# EAGLE design PCB_project (EAGLE 9.6.2)
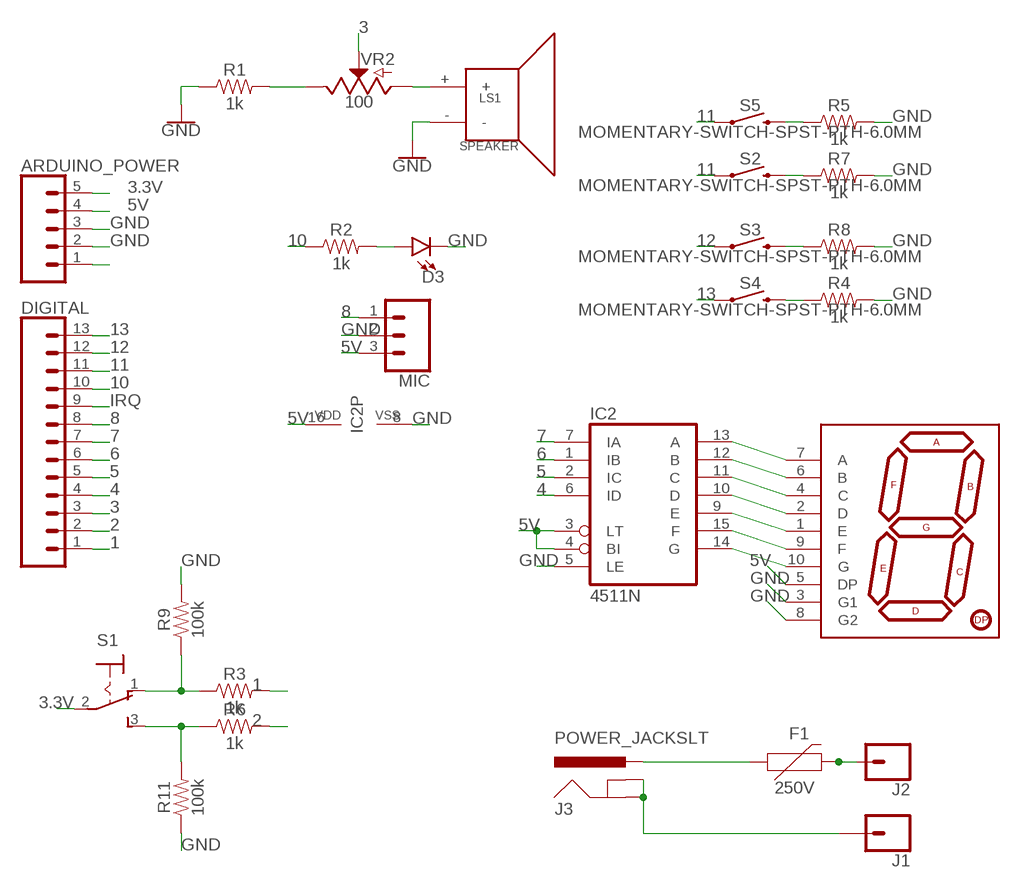
[diagram p0: schematic, sheet 1]

## Parts
ARDUINO_POWER  CONN_05  [1X05]
D3  LED-3MM-NO_SILK  [LED_3MM-NS]
DIGITAL  CONN_13  [1X13]
F1  250V  PPTC_HALF-AMP  [1206]
IC2  4511N  [DIL16]
J1  CONN_01  [1X01]
J2  CONN_01  [1X01]
J3  POWER_JACKSLT  [POWER_JACK_SLOT]
LS1  SPEAKER  [PCB_MOUNT_SPEAKER]
MIC  CONN_03  [1X03]
R1  1k  1KOHM-HORIZ-1/4W-1%  [AXIAL-0.3]
R2  1k  1KOHM-HORIZ-1/4W-1%  [AXIAL-0.3]
R3  1k  1KOHM-HORIZ-1/4W-1%  [AXIAL-0.3]
R4  1k  1KOHM-HORIZ-1/4W-1%  [AXIAL-0.3]
R5  1k  1KOHM-HORIZ-1/4W-1%  [AXIAL-0.3]
R6  1k  1KOHM-HORIZ-1/4W-1%  [AXIAL-0.3]
R7  1k  1KOHM-HORIZ-1/4W-1%  [AXIAL-0.3]
R8  1k  1KOHM-HORIZ-1/4W-1%  [AXIAL-0.3]
R9  100k  100KOHM-HORIZ-1/4W-1%  [AXIAL-0.3]
R11  100k  100KOHM-HORIZ-1/4W-1%  [AXIAL-0.3]
S1  320-916  [320-916]
S2  MOMENTARY-SWITCH-SPST-PTH-6.0MM  [TACTILE_SWITCH_PTH_6.0MM]
S3  MOMENTARY-SWITCH-SPST-PTH-6.0MM  [TACTILE_SWITCH_PTH_6.0MM]
S4  MOMENTARY-SWITCH-SPST-PTH-6.0MM  [TACTILE_SWITCH_PTH_6.0MM]
S5  MOMENTARY-SWITCH-SPST-PTH-6.0MM  [TACTILE_SWITCH_PTH_6.0MM]
U$1  YSD-160AB3C-8  7-SEGMENT-1DIGIT-1INCH-BLUE  [7-SEGMENT-1"PTH]
VR2  100  POTENTIOMETER-PTH-9MM-1/20W-20%  [POT-PTH-ALPS]

## Nets
1: DIGITAL.1 R3.P$2
2: DIGITAL.2 R6.P$2
3: DIGITAL.3 VR2.P$2(S)
3.3V: ARDUINO_POWER.5 S1.2(P)
4: DIGITAL.4 IC2.6(ID)
5: DIGITAL.5 IC2.2(IC)
5V: ARDUINO_POWER.4 IC2.3(LT) IC2.4(BI) IC2.16(VDD) MIC.3 U$1.5(DP)
6: DIGITAL.6 IC2.1(IB)
7: DIGITAL.7 IC2.7(IA)
8: DIGITAL.8 MIC.1
10: DIGITAL.10 R2.P$1
11: DIGITAL.11 S2.1 S5.1
12: DIGITAL.12 S3.1
13: DIGITAL.13 S4.1
GND: ARDUINO_POWER.2 ARDUINO_POWER.3 D3.K(C) IC2.5(LE) IC2.8(VSS) LS1.- MIC.2 R1.P$1 R4.P$2 R5.P$2 R7.P$2 R8.P$2 R9.P$2 R11.P$1 U$1.3(G1) U$1.8(G2)
IRQ: DIGITAL.9
N$1: LS1.+ VR2.P$3(A)
N$2: D3.A R2.P$2
N$3: IC2.13(A) U$1.7(A)
N$4: IC2.12(B) U$1.6(B)
N$5: IC2.11(C) U$1.4(C)
N$6: IC2.10(D) U$1.2(D)
N$7: IC2.9(E) U$1.1(E)
N$8: IC2.15(F) U$1.9(F)
N$9: IC2.14(G) U$1.10(G)
N$10: R1.P$2 VR2.P$1(E)
N$11: R3.P$1 R9.P$1 S1.1(O)
N$12: R4.P$1 S4.3
N$13: J1.1 J3.GND@1(GNDBREAK) J3.GND@2(GND)
N$14: ARDUINO_POWER.1
N$15: R6.P$1 R11.P$2 S1.3(S)
N$16: R7.P$1 S2.3
N$17: R8.P$1 S3.3
N$18: F1.1 J3.PWR
N$19: R5.P$1 S5.3
N$20: F1.2 J2.1

## Library data of the parts
ARDUINO_POWER = SparkFun-Connectors:CONN_05: Multi connection point. Often used as Generic Header-pin footprint for 0.1 inch spaced/style header connections On any of the 0.1 inch spaced packages, you can populate with these: Break Away Headers - Straight <https://www.sparkfun.com/products/116> (PRT-00116) Break Away Male Headers - Right Angle <https://www.sparkfun.com/products/553> (PRT-00553) Female Headers <https://www.sparkfun.com/products/115> (PRT-00115) Break Away Headers - Machine Pin <https://www.sparkfun.com/products/117> (PRT-00117) Break Away Female Headers - Swiss Machine Pin <https://www.sparkfun.com/products/743> (PRT-00743) For SCREWTERMINALS and SPRING TERMINALS visit here: Screw Terimnals on SparkFun.com <https://www.sparkfun.com/search/results?term=Screw+Terminals> (5mm/3.5mm/2.54mm spacing) This device is also useful as a general connection point to wire up your design to another part of your project. Our various solder wires solder well into these plated through hole pads. Hook-Up Wire - Assortment (Stranded, 22 AWG) <https://www.sparkfun.com/products/11375> (PRT-11375) Hook-Up Wire - Assortment (Solid Core, 22 AWG) <https://www.sparkfun.com/products/11367> (PRT-11367) View the entire wire category on our website here <https://www.sparkfun.com/categories/141> Special notes: Molex polarized connector foot print use with SKU : PRT-08231 with associated crimp pins and housings. 1MM SMD Version SKU: PRT-10208
D3 = SparkFun-LED:LED: LED (Generic) Standard schematic elements and footprints for 5mm, 3mm, 1206, and 0603 sized LEDs. Generic LEDs with no color specified.
DIGITAL = SparkFun-Connectors:CONN_13: Multi connection point. Often used as Generic Header-pin footprint for 0.1 inch spaced/style header connections On any of the 0.1 inch spaced packages, you can populate with these: Break Away Headers - Straight <https://www.sparkfun.com/products/116> (PRT-00116) Break Away Male Headers - Right Angle <https://www.sparkfun.com/products/553> (PRT-00553) Female Headers <https://www.sparkfun.com/products/115> (PRT-00115) Break Away Headers - Machine Pin <https://www.sparkfun.com/products/117> (PRT-00117) Break Away Female Headers - Swiss Machine Pin <https://www.sparkfun.com/products/743> (PRT-00743) For SCREWTERMINALS and SPRING TERMINALS visit here: Screw Terimnals on SparkFun.com <https://www.sparkfun.com/search/results?term=Screw+Terminals> (5mm/3.5mm/2.54mm spacing) This device is also useful as a general connection point to wire up your design to another part of your project. Our various solder wires solder well into these plated through hole pads. Hook-Up Wire - Assortment (Stranded, 22 AWG) <https://www.sparkfun.com/products/11375> (PRT-11375) Hook-Up Wire - Assortment (Solid Core, 22 AWG) <https://www.sparkfun.com/products/11367> (PRT-11367) View the entire wire category on our website here <https://www.sparkfun.com/categories/141> Special notes: Molex polarized connector foot print use with SKU : PRT-08231 with associated crimp pins and housings. 1MM SMD Version SKU: PRT-10208 NOTES ON THE VARIANTS LOCK and LOCK_LONGPADS... This footprint was designed to help hold the alignment of a through-hole component (i.e. 6-pin header) while soldering it into place. You may notice that each hole has been shifted either up or down by 0.005 of an inch from it's more standard position (which is a perfectly straight line). This slight alteration caused the pins (the squares in the middle) to touch the edges of the holes. Because they are alternating, it causes a "brace" to hold the component in place. 0.005 has proven to be the perfect amount of "off-center" position when using our standard breakaway headers. Although looks a little odd when you look at the bare footprint, once you have a header in there, the alteration is very hard to notice. Also,if you push a header all the way into place, it is covered up entirely on the bottom side.
F1 = SparkFun-Fuses:PPTC: Resettable Fuse PPTC Resettable Fuse. Really a sort of resistor with a polymeric positive temperature coefficient whose resistance increases dramatically with an increase in temperature. When heated by the power passing through the resistance rises causing the current to be limited, protecting the circuit. This is achieved by the transition of the polymer from a crystalline to an amorphous state where the conductive carbon separates breaking the conductive pathways found in the cool crystalline structure. When a PPTC cools back down it resumes conducting letting the circuit turn back on. SparkFun Products: SparkFun RedBoard - Programmed with Arduino <https://www.sparkfun.com/products/12757> Pro Micro - 5V/16MHz <https://www.sparkfun.com/products/12640> Arduino Pro 328 - 5V/16MHz <https://www.sparkfun.com/products/10915> MP3 Trigger <https://www.sparkfun.com/products/13720>; PROD_ID: RES-08585; VALUE: 6V/0.5A
IC2 = 45xx:4511: BCD to 7-segment LATCH/DECODER/DRIVER
J1 J2 = SparkFun-Connectors:CONN_01: Single connection point. Often used as Generic Header-pin footprint for 0.1 inch spaced/style header connections On any of the 0.1 inch spaced packages, you can populate with these: Break Away Headers - Straight <https://www.sparkfun.com/products/116> (PRT-00116) Break Away Male Headers - Right Angle <https://www.sparkfun.com/products/553> (PRT-00553) Female Headers <https://www.sparkfun.com/products/115> (PRT-00115) Break Away Headers - Machine Pin <https://www.sparkfun.com/products/117> (PRT-00117) Break Away Female Headers - Swiss Machine Pin <https://www.sparkfun.com/products/743> (PRT-00743) This device is also useful as a general connection point to wire up your design to another part of your project. Our various solder wires solder well into these plated through hole pads. Hook-Up Wire - Assortment (Stranded, 22 AWG) <https://www.sparkfun.com/products/11375> (PRT-11375) Hook-Up Wire - Assortment (Solid Core, 22 AWG) <https://www.sparkfun.com/products/11367> (PRT-11367) View the entire wire category on our website here <https://www.sparkfun.com/categories/141> Special notes: SMTSO-256-ET is a "flush mount" nut for a 4-40 screw. We mostly use this on specialty testbeds; it is a nice way to connect hardware to your PCB at an adjustable hieght. Also note, the SNAP packages are for using a snappable style connector. We sell a baggie of snaps and they are also used on two LilyPad designs: Snap Assortment - 30 pack (male and female) <https://www.sparkfun.com/products/11347> (DEV-11347) LilyPad Arduino SimpleSnap <https://www.sparkfun.com/products/10941> (DEV-10941) LilyPad SimpleSnap Protoboard <https://www.sparkfun.com/products/10940> (DEV-10940)
J3 = SparkFun-Connectors:POWER_JACK: Power Jack Connector This is the standard 5.5mm barrel jack for power. The PTH is the most common, proven, reliable, footprint. The Slot footprint only works if the mill layer is transmitted to the PCB fab house so be warned. Here are the connectors we sell at SparkFun: DC Barrel Power Jack/Connector <https://www.sparkfun.com/products/119> (PRT-00119) DC Barrel Power Jack/Connector (SMD) <https://www.sparkfun.com/products/12748> (PRT-12748) DC Barrel Jack Adapter - Breadboard Compatible <https://www.sparkfun.com/products/10811> (PRT-10811) It is used on this SparkFun product (and many, many others): SparkFun RedBoard - Programmed with Arduino <https://www.sparkfun.com/products/12757> (DEV-12757) Also, if you need a mating power supply or connector, please check these out: Wall Adapter Power Supply - 9VDC 650mA <https://www.sparkfun.com/products/298> (TOL-00298) DC Barrel Jack Adapter - Male <https://www.sparkfun.com/products/10287> (PRT-10287); PROD_ID: PRT-00119
LS1 = SparkFun-Electromechanical:SPEAKER: Speaker Generic 2-terminal loudspeakers SparkFun Products Speaker - PCB Mount <https://www.sparkfun.com/products/11089> (COM-11089); PROD_ID: COMP-11789; SF_SKU: COM-11089
MIC = SparkFun-Connectors:CONN_03: Multi connection point. Often used as Generic Header-pin footprint for 0.1 inch spaced/style header connections On any of the 0.1 inch spaced packages, you can populate with these: Break Away Headers - Straight <https://www.sparkfun.com/products/116> (PRT-00116) Break Away Male Headers - Right Angle <https://www.sparkfun.com/products/553> (PRT-00553) Female Headers <https://www.sparkfun.com/products/115> (PRT-00115) Break Away Headers - Machine Pin <https://www.sparkfun.com/products/117> (PRT-00117) Break Away Female Headers - Swiss Machine Pin <https://www.sparkfun.com/products/743> (PRT-00743) Stackable Header - 3 Pin (Female, 0.1") <https://www.sparkfun.com/products/13875> (PRT-13875) For SCREWTERMINALS and SPRING TERMINALS visit here: Screw Terimnals on SparkFun.com <https://www.sparkfun.com/search/results?term=Screw+Terminals> (5mm/3.5mm/2.54mm spacing) This device is also useful as a general connection point to wire up your design to another part of your project. Our various solder wires solder well into these plated through hole pads. Hook-Up Wire - Assortment (Stranded, 22 AWG) <https://www.sparkfun.com/products/11375> (PRT-11375) Hook-Up Wire - Assortment (Solid Core, 22 AWG) <https://www.sparkfun.com/products/11367> (PRT-11367) View the entire wire category on our website here <https://www.sparkfun.com/categories/141> Special notes: Molex polarized connector foot print use with SKU : PRT-08232 with associated crimp pins and housings.
R1-R8 = SparkFun-Resistors:1KOHM: 1kΩ resistor A resistor is a passive two-terminal electrical component that implements electrical resistance as a circuit element. Resistors act to reduce current flow, and, at the same time, act to lower voltage levels within circuits. - Wikipedia; PROD_ID: RES-12182
R9 R11 = SparkFun-Resistors:100KOHM: 100kΩ resistor A resistor is a passive two-terminal electrical component that implements electrical resistance as a circuit element. Resistors act to reduce current flow, and, at the same time, act to lower voltage levels within circuits. - Wikipedia; PROD_ID: RES-12184
S1 = switch:320-916: TOGGLE SWITCH distributor RS Components
S2-S5 = SparkFun-Switches:MOMENTARY-SWITCH-SPST: Momentary Switch (Pushbutton) - SPST Normally-open (NO) SPST momentary switches (buttons, pushbuttons). Variants PTH-12MM - 12mm square, through-hole Momentary Pushbutton Switch - 12mm Square <https://www.sparkfun.com/products/9190> (COM-09190) PTH-6.0MM, PTH-6.0MM-KIT - 6.0mm square, through-hole Mini Pushbutton Switch <https://www.sparkfun.com/products/97> (COM-00097) KIT package intended for soldering kit's - only one side of pads' copper is exposed. PTH-RIGHT-ANGLE-KIT - Right-angle, through-hole Right Angle Tactile Button <https://www.sparkfun.com/products/10791> - Used on SparkFun BigTime Watch Kit <https://www.sparkfun.com/products/11734> SMD-12MM - 12mm square, surface-mount Tactile Button - SMD (12mm) <https://www.sparkfun.com/products/12993> (COM-12993) Used on SparkFun PicoBoard <https://www.sparkfun.com/products/11888> SMD-4.5MM - 4.5mm Square Trackball Switch Used on SparkFun Blackberry Trackballer Breakout <https://www.sparkfun.com/products/13169> SMD-4.6MMX2.8MM - 4.60mm x 2.80mm, surface mount Used on SparkFun SAMD21 Mini Breakout <https://www.sparkfun.com/products/13664> SMD-5.2MM, SMD-5.2-REDUNDANT - 5.2mm square, surface-mount Mini Pushbutton Switch - SMD <https://www.sparkfun.com/products/8720> (COM-08720) Used on Arduino Pro Mini <https://www.sparkfun.com/products/11114> REDUNDANT package connects both switch circuits together SMD-6.0X3.5MM - 6.0 x 3.5mm, surface mount Momentary Reset Switch SMD <https://www.sparkfun.com/products/8229> (COM-08229) SMD-6.2MM-TALL - 6.2mm square, surface mount Tactile Button - SMD (6mm) <https://www.sparkfun.com/products/12992> Used on SparkFun Digital Sandbox <https://www.sparkfun.com/products/12651> SMD-RIGHT-ANGLE - Right-angle, surface mount Used on SparkFun Block for Intel® Edison - Arduino <https://www.sparkfun.com/products/13036>; PROD_ID: SWCH-08441; SF_SKU: COM-00097
U$1 = SparkFun-LED:7-SEGMENT-1DIGIT-1INCH: 7-Segment Display, single digit, 1" EZ is for kits. Pads are only exposed on the bottom side to help prevent soldering in upside down. Datasheet (Red) <https://cdn.sparkfun.com/datasheets/Components/LED/YSD-160AR4B-8.pdf> Datasheet (Blue) <https://cdn.sparkfun.com/datasheets/Components/LED/YSD-160AB3C-8.pdf> SparkFun Products 7-Segment Display - LED (Red) <https://www.sparkfun.com/products/8546> (COM-08546) 7-Segment Display - LED (Blue) <https://www.sparkfun.com/products/9191> (COM-09191); PROD_ID: COMP-09495
VR2 = SparkFun-Resistors:POTENTIOMETER: Potentiometer (Pot) Three-terminal potentiometers, with an adjustable wiper and two adjustable resistors. A pot can be used to create a configurable voltage divider, or as a variable resistor. Variants ALPS_POT and ALPS_POT_KIT - PTH, breadboard compatible, 9mm square pots Rotary Potentiometer - Linear (10k ohm) <https://www.sparkfun.com/products/9288> (COM-09288) The KIT variant exposes copper on only one side of the PTH pad, so the part can only be assembled on one side of the PCB. Useful for beginner soldering kits.; PROD_ID: RES-09177; SF_SKU: COM-09288; VALUE: 10k

## Board
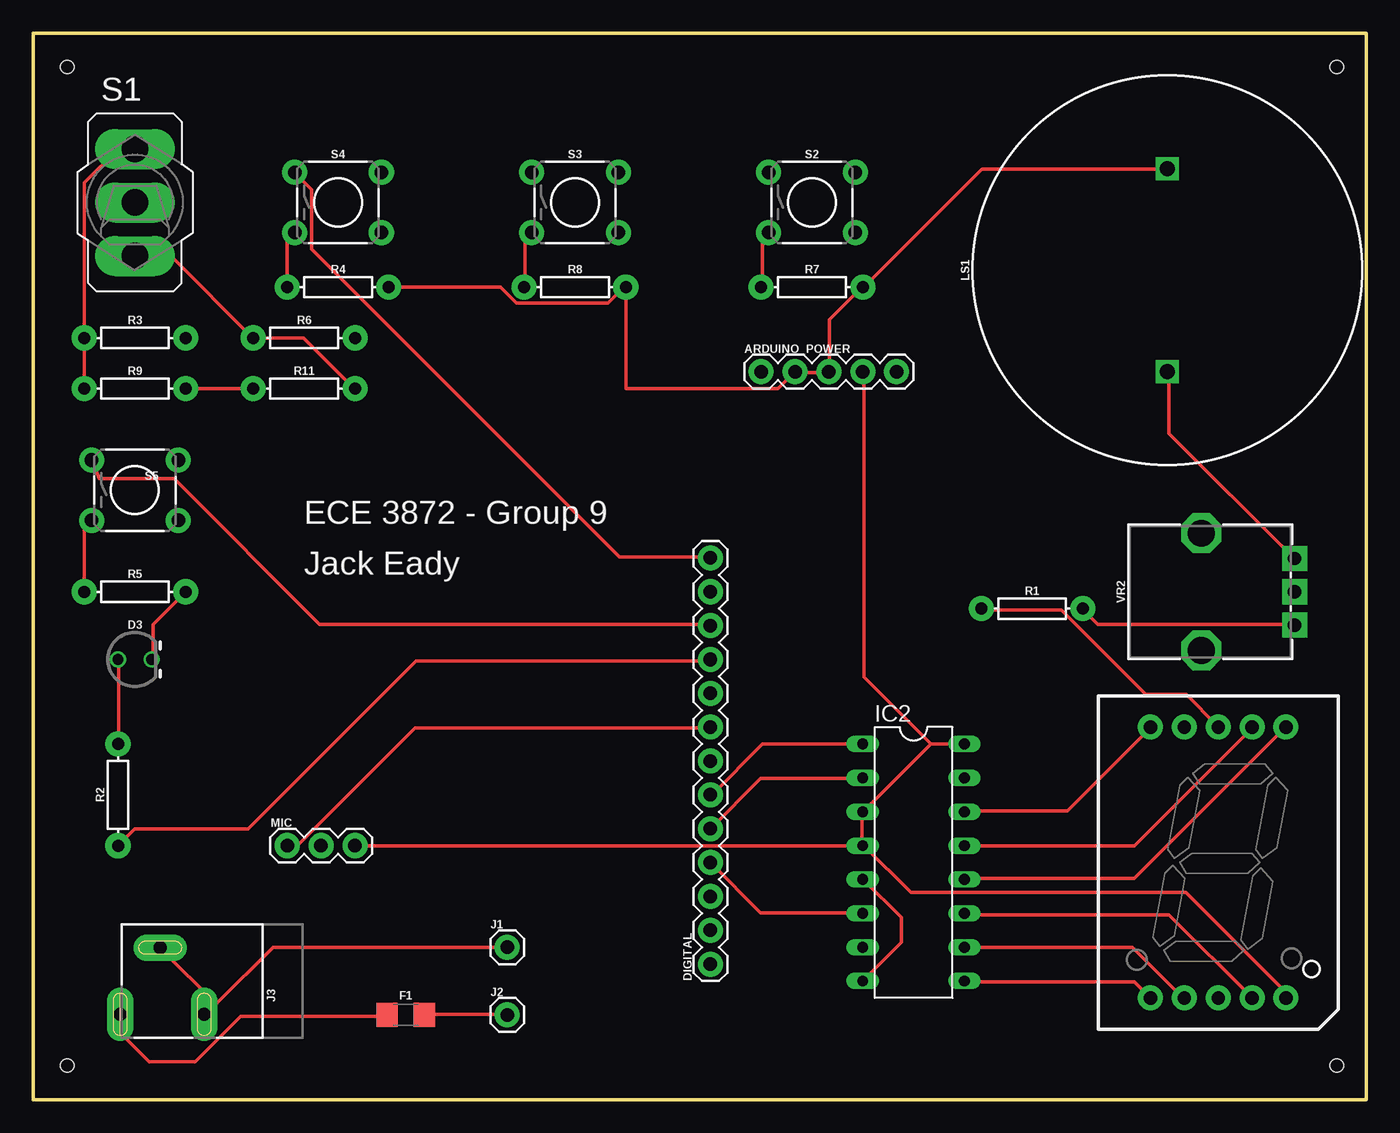
[diagram p1: board, top side]
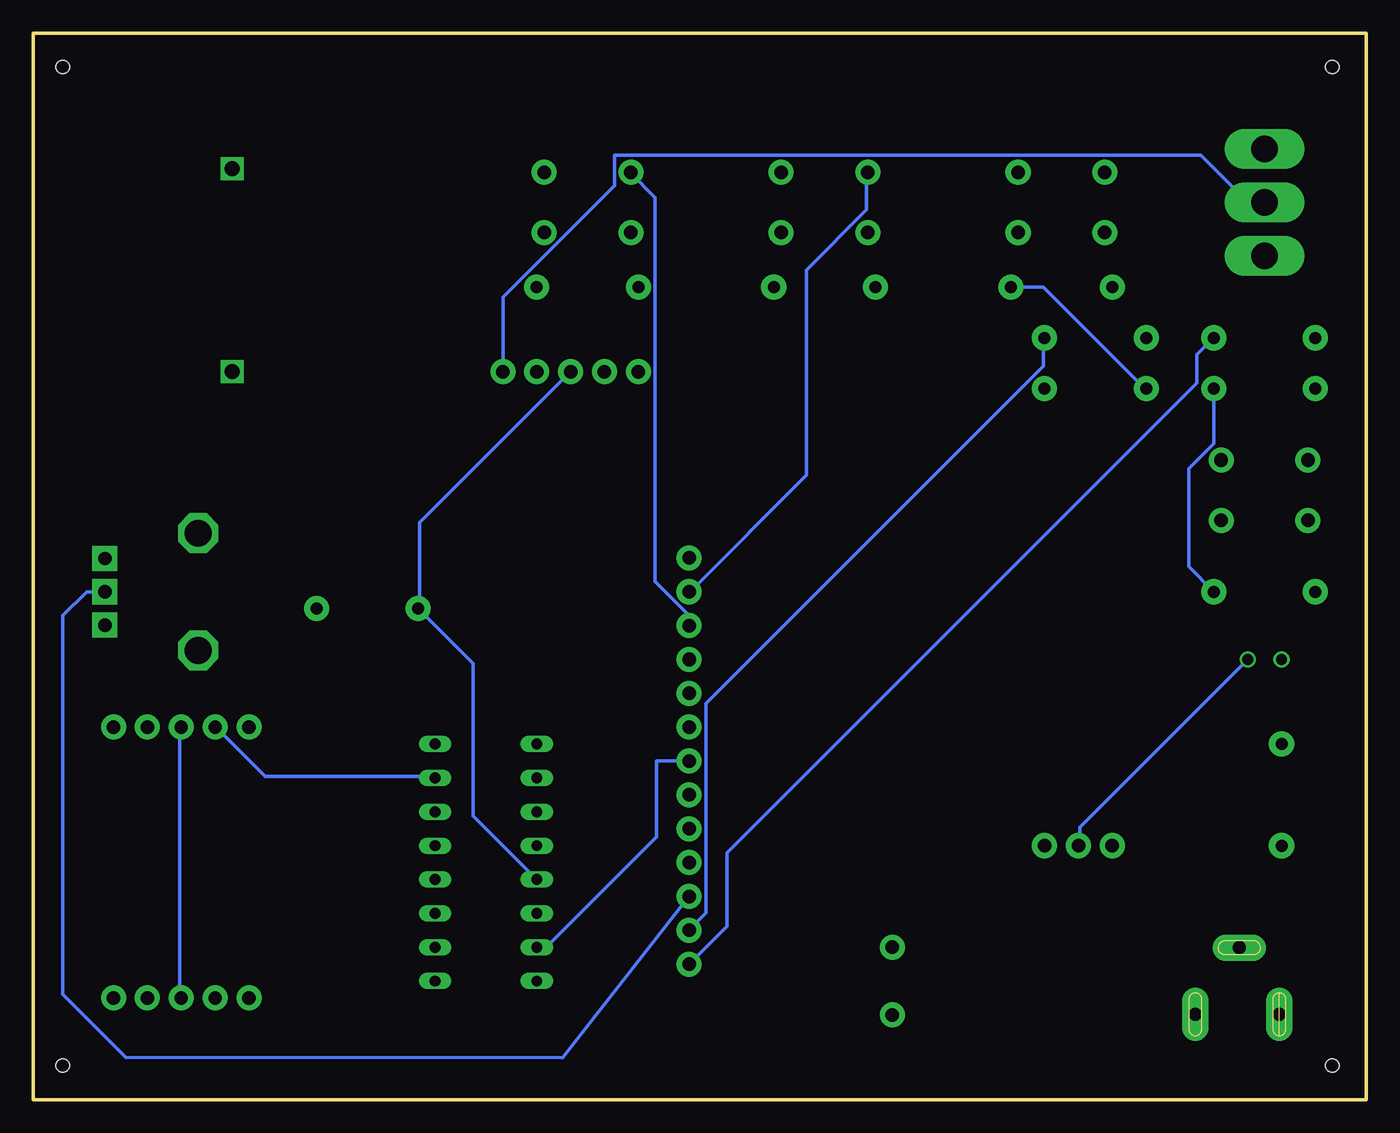
[diagram p2: board, bottom side, seen from below]

Size 100 x 80 mm. Coordinates in mm from the lower left corner, seen from the top.
Outline: 0,0 100,0 100,80 0,80 0,0
Copper layers (1*16): Top 0.035559375mm / dielectric 1.6mm / Bottom 0.035559375mm
Design rules "jlcpcb2layer": minimum track width 5mil, minimum drill 12mil, track to track 5mil, track to pad 5mil, pad to pad 5mil, via to via 5mil, smd to smd 5mil, copper to edge 8mil, drill to drill 6mil, minimum pad ring 5mil, minimum via ring 3mil, stop-mask expansion 2.5mil, vias tented up to drill 0mil, thermal gap 10mil
Holes 1 mm at 2.54,77.47 97.79,77.47 97.79,2.54 2.54,2.54

### Footprints (pad centres in the part's own frame; a part is rotated, then mirrored left to right if it is on the bottom)
1X05 = drill 1.016 pad 1.88: 1 0,0; 2 2.54,0; 3 5.08,0; 4 7.62,0; 5 10.16,0
LED_3MM-NS = drill 0.813: A -1.27,0; K 1.27,0
1X13 = drill 1.016 pad 1.88: 1 0,0; 2 2.54,0; 3 5.08,0; 4 7.62,0; 5 10.16,0; 6 12.7,0; 7 15.24,0; 8 17.78,0; 9 20.32,0; 10 22.86,0; 11 25.4,0; 12 27.94,0; 13 30.48,0
1206 = smd 1.6 x 1.8: 1 -1.4,0; 2 1.4,0
DIL16 = drill 0.813 long: 1 -8.89,-3.81; 2 -6.35,-3.81; 3 -3.81,-3.81; 4 -1.27,-3.81; 5 1.27,-3.81; 6 3.81,-3.81; 7 6.35,-3.81; 8 8.89,-3.81; 9 8.89,3.81; 10 6.35,3.81; 11 3.81,3.81; 12 1.27,3.81; 13 -1.27,3.81; 14 -3.81,3.81; 15 -6.35,3.81; 16 -8.89,3.81
1X01 = drill 1.016 pad 1.88: 1 0,0
POWER_JACK_SLOT = drill 1 pad 2 long: GND@1 2.58,7.5; GND@2 7.58,10.8; PWR 2.58,13.8
PCB_MOUNT_SPEAKER = drill 1.143 square: + -7.62,0; - 7.62,0
1X03 = drill 1.016 pad 1.88: 1 0,0; 2 2.54,0; 3 5.08,0
AXIAL-0.3 = drill 0.9 pad 1.88: P$1 -3.81,0; P$2 3.81,0
320-916 = drill 2.007 long: 1 0,4.013; 2 0,0; 3 0,-4.013
TACTILE_SWITCH_PTH_6.0MM = drill 1.016 pad 1.88: 1 -3.251,2.261; 2 3.251,2.261; 3 -3.251,-2.261; 4 3.251,-2.261
7-SEGMENT-1"PTH = drill 1 pad 1.88: 1 -5.08,-10.16; 2 -2.54,-10.16; 3 0,-10.16; 4 2.54,-10.16; 5 5.08,-10.16; 6 5.08,10.16; 7 2.54,10.16; 8 0,10.16; 9 -2.54,10.16; 10 -5.08,10.16
POT-PTH-ALPS = drill 1 pad 1.88 square: P$1 7,-2.5; P$2 7,0; P$3 7,2.5 | drill 2 octagon: P$4 0,-4.4; P$5 0,4.4

### Placement (x,y rotation side)
ARDUINO_POWER  54.61,54.61 0 top
D3  7.62,33.02 0 top
DIGITAL  50.8,10.16 90 top
F1  27.94,6.35 0 top
IC2  66.04,17.78 270 top
J1  35.56,11.43 0 top
J2  35.56,6.35 0 top
J3  20.32,3.81 90 top
LS1  85.09,62.23 90 top
MIC  19.05,19.05 0 top
R1  74.93,36.83 0 top
R2  6.35,22.86 90 top
R3  7.62,57.15 0 top
R4  22.86,60.96 0 top
R5  7.62,38.1 0 top
R6  20.32,57.15 0 top
R7  58.42,60.96 0 top
R8  40.64,60.96 0 top
R9  7.62,53.34 0 top
R11  20.32,53.34 0 top
S1  7.62,67.31 0 top
S2  58.42,67.31 0 top
S3  40.64,67.31 0 top
S4  22.86,67.31 0 top
S5  7.62,45.72 0 top
U$1  88.9,17.78 0 top
VR2  87.63,38.1 0 top

### Tracks (layer width: path | path; a pad name or v marks a point on that pad's centre or on a via)
1
  Bottom 0.254: R3.P$2 12.7,55.88 12.7,53.75 47.95,18.49 47.95,13.01 DIGITAL.1
2
  Bottom 0.254: R6.P$2 24.23,57.15 24.23,55.02 49.53,29.72 49.53,14.02 50.75,12.8 DIGITAL.2
3
  Bottom 0.254: DIGITAL.3 60.28,3.13 93.06,3.17 97.79,7.89 97.79,36.32 96.01,38.1 VR2.P$2
3.3V
  Bottom 0.254: ARDUINO_POWER.5 64.77,60.2 56.39,68.58 56.39,70.87 12.39,70.87 8.84,67.31 S1.2
4
  Top 0.254: DIGITAL.4 54.56,14.02 62.18,14.02 IC2.6
5
  Top 0.254: DIGITAL.5 54.56,24.08 62.18,24.08 IC2.2
5V
  Top 0.254: 62.18,19.05 62.18,21.49 IC2.3 62.33,21.64 67.36,26.67 | 67.36,26.67 IC2.16 | U$1.5 93.98,8.03 86.46,15.54 65.84,15.54 62.33,19.05 IC2.4 62.18,19.05 | 62.18,19.05 MIC.3 | 67.36,26.67 62.33,31.7 62.33,54.56 ARDUINO_POWER.4
6
  Top 0.254: IC2.1 54.71,26.67 50.9,22.86 DIGITAL.6
7
  Bottom 0.254: IC2.7 61.52,11.43 53.24,19.71 53.24,25.4 DIGITAL.7
8
  Top 0.254: MIC.1 19.81,19.05 28.65,27.89 50.75,27.89 DIGITAL.8
10
  Top 0.254: R2.P$1 7.62,20.32 16.1,20.32 28.7,32.92 50.75,32.92 DIGITAL.10
11
  Top 0.254: S5.1 4.93,46.58 10.57,46.58 21.49,35.66 50.75,35.66 DIGITAL.11
  Bottom 0.254: DIGITAL.11 50.9,35.66 50.9,36.42 53.34,38.86 53.34,67.67 55.17,69.49 S2.1
12
  Bottom 0.254: S3.1 37.49,69.49 37.49,66.75 42.01,62.23 42.01,46.84 50.75,38.1 DIGITAL.12
13
  Top 0.254: DIGITAL.13 50.75,40.69 43.99,40.69 20.88,63.8 20.88,68.28 19.66,69.49 S4.1
GND
  Top 0.254: R11.P$1 R9.P$2 | R5.P$2 8.99,35.66 8.99,33.07 D3.K | IC2.8 65.13,11.79 65.13,13.66 62.33,16.46 IC2.5 | R1.P$1 71.12,36.73 77.11,36.73 83.46,30.38 86.51,30.38 88.85,28.04 U$1.8 | LS1.- 85.04,69.8 71.17,69.8 62.33,60.96 R7.P$2 62.18,60.96 59.74,58.52 59.74,54.71 ARDUINO_POWER.3 59.59,54.56 57.15,54.56 ARDUINO_POWER.2 55.88,53.34 44.45,53.34 R8.P$2 44.35,60.96 43.13,59.74 36.27,59.74 35.05,60.96 R4.P$2
  Bottom 0.254: R4.P$2 24.23,60.96 16.61,53.34 R11.P$1 | D3.K 21.49,20.42 21.49,19.05 MIC.2 | R9.P$2 11.43,49.23 13.31,47.35 13.31,39.98 R5.P$2 | U$1.3 89,7.62 89,27.89 U$1.8 | IC2.5 67,21.29 67,32.72 R1.P$1 71.02,36.88 71.02,43.28 ARDUINO_POWER.3
N$1
  Top 0.254: LS1.+ 85.19,54.56 85.19,49.99 94.49,40.69 VR2.P$3
N$2
  Top 0.254: D3.A 6.4,32.92 6.4,26.67 R2.P$2
N$3
  Top 0.254: IC2.13 82.6,19.05 91.44,27.89 U$1.7
N$4
  Top 0.254: IC2.12 69.95,16.61 82.6,16.61 93.88,27.89 U$1.6
N$5
  Top 0.254: U$1.4 85.19,13.87 69.95,13.87 IC2.11
N$6
  Top 0.254: IC2.10 82.45,11.43 86.26,7.62 U$1.2
N$7
  Top 0.254: U$1.1 82.6,8.84 69.95,8.84 IC2.9
N$8
  Bottom 0.254: IC2.15 69.95,24.23 82.6,24.23 86.26,27.89 U$1.9
N$9
  Top 0.254: IC2.14 69.95,21.64 77.57,21.64 83.82,27.89 U$1.10
N$10
  Top 0.254: VR2.P$1 94.49,35.66 79.86,35.66 78.79,36.73 R1.P$2
N$11
  Top 0.254: R9.P$1 R3.P$1 3.81,68.78 6.35,71.32 S1.1
N$12
  Top 0.254: R4.P$1 19.05,64.47 19.51,64.92 S4.3
N$13
  Top 0.254: J1.1 17.98,11.43 13.72,7.16 | 13.72,7.16 12.95,6.4 J3.GND@1 13.72,7.16 | 13.72,7.16 9.6,11.28 J3.GND@2
N$15
  Top 0.254: R11.P$2 24.08,53.34 20.27,57.15 R6.P$1 16.46,57.15 10.36,63.25 7.62,63.25 S1.3
N$16
  Top 0.254: R7.P$1 54.71,60.96 54.71,64.47 55.17,64.92 S2.3
N$17
  Top 0.254: R8.P$1 36.88,60.96 36.88,64.47 37.34,64.92 S3.3
N$18
  Top 0.254: F1.1 26.52,6.25 15.54,6.25 12.14,2.85 8.69,2.85 6.94,4.59 J3.PWR
N$19
  Top 0.254: R5.P$1 3.81,42.98 4.27,43.43 S5.3
N$20
  Top 0.254: F1.2 29.41,6.4 35.51,6.4 J2.1

### Text on the board
tPlace: ECE 3872 - Group 9 | Jack Eady